# Altium schematic sheet FMC_HPC_UFL_DEBUG_J1_J84.SchDoc: 84 U.FL connectors J1 .. J84 (12 x 7 array)
size A4; Date: 13.12.2024; ApprovedBy: PFH; CompanyName: IAM Electronic GmbH; DrawnBy: PFH; Engineer: PFH; DocumentNumber: 2; Revision: A; SheetNumber: 2; SheetTotal: 9; Projekt: FMC HPC-U.FL Debug Board; Website: www.fmchub.com
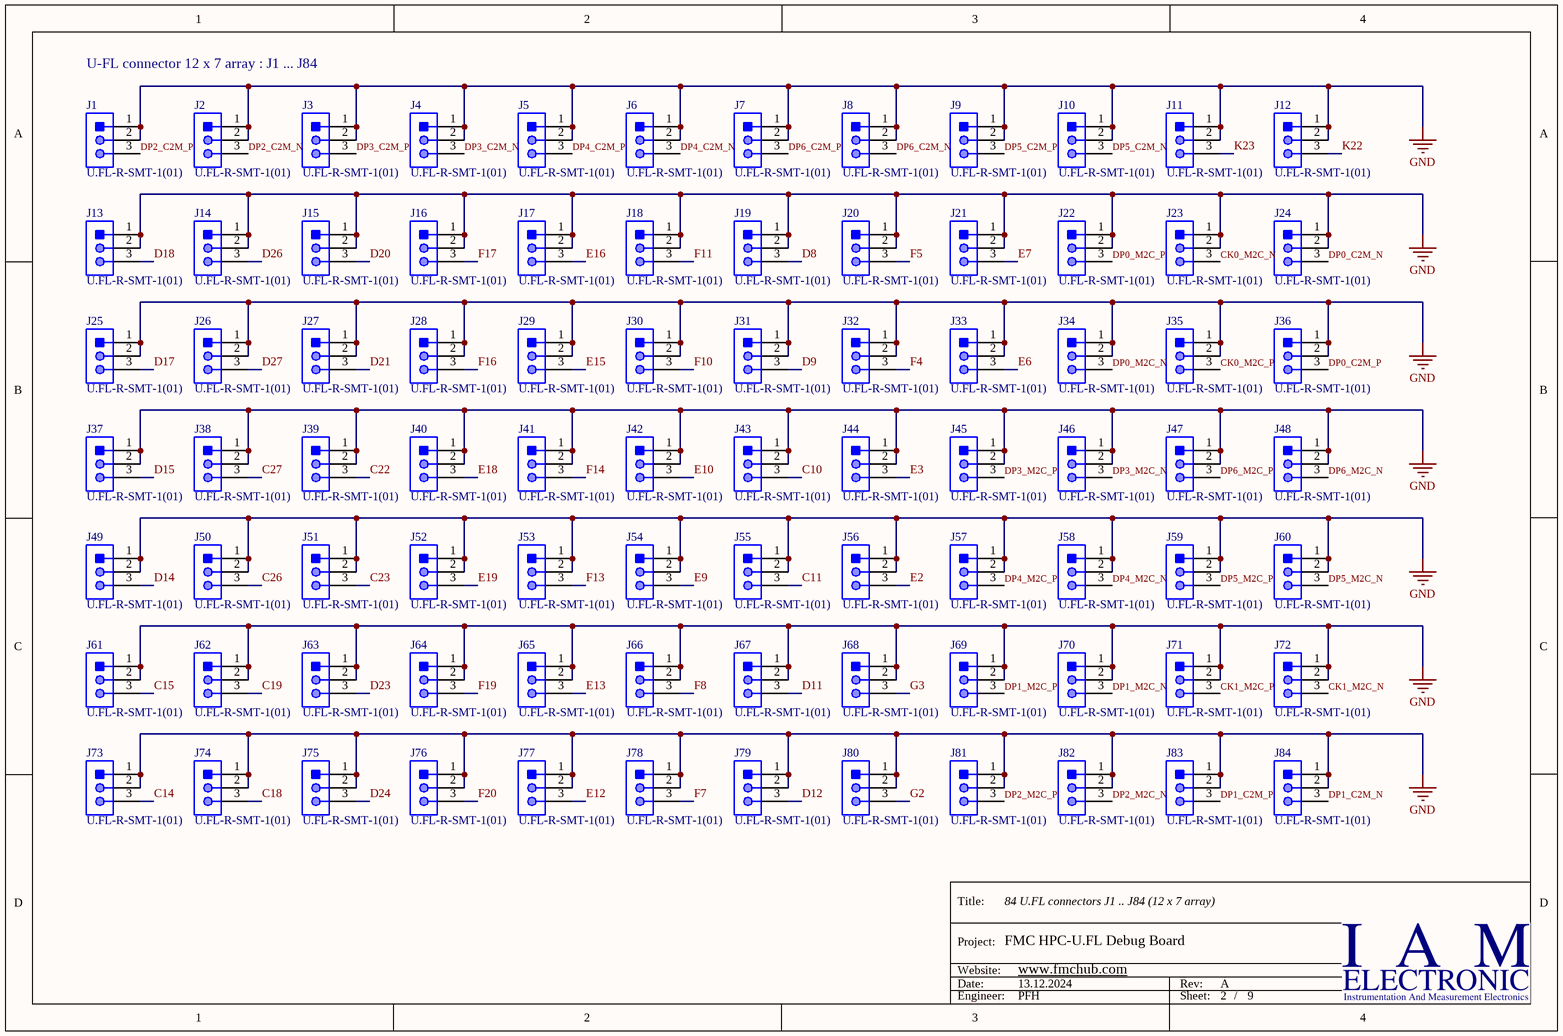
[diagram p0: FMC_HPC_UFL_DEBUG_J1_J84.SchDoc]

## Parts
J1  U.FL-R-SMT-1(01)  [HRS-U.FL-R-SMT-3_V]
J2  U.FL-R-SMT-1(01)  [HRS-U.FL-R-SMT-3_V]
J3  U.FL-R-SMT-1(01)  [HRS-U.FL-R-SMT-3_V]
J4  U.FL-R-SMT-1(01)  [HRS-U.FL-R-SMT-3_V]
J5  U.FL-R-SMT-1(01)  [HRS-U.FL-R-SMT-3_V]
J6  U.FL-R-SMT-1(01)  [HRS-U.FL-R-SMT-3_V]
J7  U.FL-R-SMT-1(01)  [HRS-U.FL-R-SMT-3_V]
J8  U.FL-R-SMT-1(01)  [HRS-U.FL-R-SMT-3_V]
J9  U.FL-R-SMT-1(01)  [HRS-U.FL-R-SMT-3_V]
J10  U.FL-R-SMT-1(01)  [HRS-U.FL-R-SMT-3_V]
J11  U.FL-R-SMT-1(01)  [HRS-U.FL-R-SMT-3_V]
J12  U.FL-R-SMT-1(01)  [HRS-U.FL-R-SMT-3_V]
J13  U.FL-R-SMT-1(01)  [HRS-U.FL-R-SMT-3_V]
J14  U.FL-R-SMT-1(01)  [HRS-U.FL-R-SMT-3_V]
J15  U.FL-R-SMT-1(01)  [HRS-U.FL-R-SMT-3_V]
J16  U.FL-R-SMT-1(01)  [HRS-U.FL-R-SMT-3_V]
J17  U.FL-R-SMT-1(01)  [HRS-U.FL-R-SMT-3_V]
J18  U.FL-R-SMT-1(01)  [HRS-U.FL-R-SMT-3_V]
J19  U.FL-R-SMT-1(01)  [HRS-U.FL-R-SMT-3_V]
J20  U.FL-R-SMT-1(01)  [HRS-U.FL-R-SMT-3_V]
J21  U.FL-R-SMT-1(01)  [HRS-U.FL-R-SMT-3_V]
J22  U.FL-R-SMT-1(01)  [HRS-U.FL-R-SMT-3_V]
J23  U.FL-R-SMT-1(01)  [HRS-U.FL-R-SMT-3_V]
J24  U.FL-R-SMT-1(01)  [HRS-U.FL-R-SMT-3_V]
J25  U.FL-R-SMT-1(01)  [HRS-U.FL-R-SMT-3_V]
J26  U.FL-R-SMT-1(01)  [HRS-U.FL-R-SMT-3_V]
J27  U.FL-R-SMT-1(01)  [HRS-U.FL-R-SMT-3_V]
J28  U.FL-R-SMT-1(01)  [HRS-U.FL-R-SMT-3_V]
J29  U.FL-R-SMT-1(01)  [HRS-U.FL-R-SMT-3_V]
J30  U.FL-R-SMT-1(01)  [HRS-U.FL-R-SMT-3_V]
J31  U.FL-R-SMT-1(01)  [HRS-U.FL-R-SMT-3_V]
J32  U.FL-R-SMT-1(01)  [HRS-U.FL-R-SMT-3_V]
J33  U.FL-R-SMT-1(01)  [HRS-U.FL-R-SMT-3_V]
J34  U.FL-R-SMT-1(01)  [HRS-U.FL-R-SMT-3_V]
J35  U.FL-R-SMT-1(01)  [HRS-U.FL-R-SMT-3_V]
J36  U.FL-R-SMT-1(01)  [HRS-U.FL-R-SMT-3_V]
J37  U.FL-R-SMT-1(01)  [HRS-U.FL-R-SMT-3_V]
J38  U.FL-R-SMT-1(01)  [HRS-U.FL-R-SMT-3_V]
J39  U.FL-R-SMT-1(01)  [HRS-U.FL-R-SMT-3_V]
J40  U.FL-R-SMT-1(01)  [HRS-U.FL-R-SMT-3_V]
J41  U.FL-R-SMT-1(01)  [HRS-U.FL-R-SMT-3_V]
J42  U.FL-R-SMT-1(01)  [HRS-U.FL-R-SMT-3_V]
J43  U.FL-R-SMT-1(01)  [HRS-U.FL-R-SMT-3_V]
J44  U.FL-R-SMT-1(01)  [HRS-U.FL-R-SMT-3_V]
J45  U.FL-R-SMT-1(01)  [HRS-U.FL-R-SMT-3_V]
J46  U.FL-R-SMT-1(01)  [HRS-U.FL-R-SMT-3_V]
J47  U.FL-R-SMT-1(01)  [HRS-U.FL-R-SMT-3_V]
J48  U.FL-R-SMT-1(01)  [HRS-U.FL-R-SMT-3_V]
J49  U.FL-R-SMT-1(01)  [HRS-U.FL-R-SMT-3_V]
J50  U.FL-R-SMT-1(01)  [HRS-U.FL-R-SMT-3_V]
J51  U.FL-R-SMT-1(01)  [HRS-U.FL-R-SMT-3_V]
J52  U.FL-R-SMT-1(01)  [HRS-U.FL-R-SMT-3_V]
J53  U.FL-R-SMT-1(01)  [HRS-U.FL-R-SMT-3_V]
J54  U.FL-R-SMT-1(01)  [HRS-U.FL-R-SMT-3_V]
J55  U.FL-R-SMT-1(01)  [HRS-U.FL-R-SMT-3_V]
J56  U.FL-R-SMT-1(01)  [HRS-U.FL-R-SMT-3_V]
J57  U.FL-R-SMT-1(01)  [HRS-U.FL-R-SMT-3_V]
J58  U.FL-R-SMT-1(01)  [HRS-U.FL-R-SMT-3_V]
J59  U.FL-R-SMT-1(01)  [HRS-U.FL-R-SMT-3_V]
J60  U.FL-R-SMT-1(01)  [HRS-U.FL-R-SMT-3_V]
J61  U.FL-R-SMT-1(01)  [HRS-U.FL-R-SMT-3_V]
J62  U.FL-R-SMT-1(01)  [HRS-U.FL-R-SMT-3_V]
J63  U.FL-R-SMT-1(01)  [HRS-U.FL-R-SMT-3_V]
J64  U.FL-R-SMT-1(01)  [HRS-U.FL-R-SMT-3_V]
J65  U.FL-R-SMT-1(01)  [HRS-U.FL-R-SMT-3_V]
J66  U.FL-R-SMT-1(01)  [HRS-U.FL-R-SMT-3_V]
J67  U.FL-R-SMT-1(01)  [HRS-U.FL-R-SMT-3_V]
J68  U.FL-R-SMT-1(01)  [HRS-U.FL-R-SMT-3_V]
J69  U.FL-R-SMT-1(01)  [HRS-U.FL-R-SMT-3_V]
J70  U.FL-R-SMT-1(01)  [HRS-U.FL-R-SMT-3_V]
J71  U.FL-R-SMT-1(01)  [HRS-U.FL-R-SMT-3_V]
J72  U.FL-R-SMT-1(01)  [HRS-U.FL-R-SMT-3_V]
J73  U.FL-R-SMT-1(01)  [HRS-U.FL-R-SMT-3_V]
J74  U.FL-R-SMT-1(01)  [HRS-U.FL-R-SMT-3_V]
J75  U.FL-R-SMT-1(01)  [HRS-U.FL-R-SMT-3_V]
J76  U.FL-R-SMT-1(01)  [HRS-U.FL-R-SMT-3_V]
J77  U.FL-R-SMT-1(01)  [HRS-U.FL-R-SMT-3_V]
J78  U.FL-R-SMT-1(01)  [HRS-U.FL-R-SMT-3_V]
J79  U.FL-R-SMT-1(01)  [HRS-U.FL-R-SMT-3_V]
J80  U.FL-R-SMT-1(01)  [HRS-U.FL-R-SMT-3_V]
J81  U.FL-R-SMT-1(01)  [HRS-U.FL-R-SMT-3_V]
J82  U.FL-R-SMT-1(01)  [HRS-U.FL-R-SMT-3_V]
J83  U.FL-R-SMT-1(01)  [HRS-U.FL-R-SMT-3_V]
J84  U.FL-R-SMT-1(01)  [HRS-U.FL-R-SMT-3_V]

## Nets
GND: J1.1 J1.2 J2.1 J2.2 J3.1 J3.2 J4.1 J4.2 J5.1 J5.2 J6.1 J6.2 J7.1 J7.2 J8.1 J8.2 J9.1 J9.2 J10.1 J10.2 J11.1 J11.2 J12.1 J12.2 J13.1 J13.2 J14.1 J14.2 J15.1 J15.2 J16.1 J16.2 J17.1 J17.2 J18.1 J18.2 J19.1 J19.2 J20.1 J20.2 J21.1 J21.2 J22.1 J22.2 J23.1 J23.2 J24.1 J24.2 J25.1 J25.2 J26.1 J26.2 J27.1 J27.2 J28.1 J28.2 J29.1 J29.2 J30.1 J30.2 J31.1 J31.2 J32.1 J32.2 J33.1 J33.2 J34.1 J34.2 J35.1 J35.2 J36.1 J36.2 J37.1 J37.2 J38.1 J38.2 J39.1 J39.2 J40.1 J40.2 J41.1 J41.2 J42.1 J42.2 J43.1 J43.2 J44.1 J44.2 J45.1 J45.2 J46.1 J46.2 J47.1 J47.2 J48.1 J48.2 J49.1 J49.2 J50.1 J50.2 J51.1 J51.2 J52.1 J52.2 J53.1 J53.2 J54.1 J54.2 J55.1 J55.2 J56.1 J56.2 J57.1 J57.2 J58.1 J58.2 J59.1 J59.2 J60.1 J60.2 J61.1 J61.2 J62.1 J62.2 J63.1 J63.2 J64.1 J64.2 J65.1 J65.2 J66.1 J66.2 J67.1 J67.2 J68.1 J68.2 J69.1 J69.2 J70.1 J70.2 J71.1 J71.2 J72.1 J72.2 J73.1 J73.2 J74.1 J74.2 J75.1 J75.2 J76.1 J76.2 J77.1 J77.2 J78.1 J78.2 J79.1 J79.2 J80.1 J80.2 J81.1 J81.2 J82.1 J82.2 J83.1 J83.2 J84.1 J84.2
C10: J43.3
C11: J55.3
C14: J73.3
C15: J61.3
C18: J74.3
C19: J62.3
C22: J39.3
C23: J51.3
C26: J50.3
C27: J38.3
CK0_M2C_N: J23.3
CK0_M2C_P: J35.3
CK1_M2C_N: J72.3
CK1_M2C_P: J71.3
D8: J19.3
D9: J31.3
D11: J67.3
D12: J79.3
D14: J49.3
D15: J37.3
D17: J25.3
D18: J13.3
D20: J15.3
D21: J27.3
D23: J63.3
D24: J75.3
D26: J14.3
D27: J26.3
DP0_C2M_N: J24.3
DP0_C2M_P: J36.3
DP0_M2C_N: J34.3
DP0_M2C_P: J22.3
DP1_C2M_N: J84.3
DP1_C2M_P: J83.3
DP1_M2C_N: J70.3
DP1_M2C_P: J69.3
DP2_C2M_N: J2.3
DP2_C2M_P: J1.3
DP2_M2C_N: J82.3
DP2_M2C_P: J81.3
DP3_C2M_N: J4.3
DP3_C2M_P: J3.3
DP3_M2C_N: J46.3
DP3_M2C_P: J45.3
DP4_C2M_N: J6.3
DP4_C2M_P: J5.3
DP4_M2C_N: J58.3
DP4_M2C_P: J57.3
DP5_C2M_N: J10.3
DP5_C2M_P: J9.3
DP5_M2C_N: J60.3
DP5_M2C_P: J59.3
DP6_C2M_N: J8.3
DP6_C2M_P: J7.3
DP6_M2C_N: J48.3
DP6_M2C_P: J47.3
E2: J56.3
E3: J44.3
E6: J33.3
E7: J21.3
E9: J54.3
E10: J42.3
E12: J77.3
E13: J65.3
E15: J29.3
E16: J17.3
E18: J40.3
E19: J52.3
F4: J32.3
F5: J20.3
F7: J78.3
F8: J66.3
F10: J30.3
F11: J18.3
F13: J53.3
F14: J41.3
F16: J28.3
F17: J16.3
F19: J64.3
F20: J76.3
G2: J80.3
G3: J68.3
K22: J12.3
K23: J11.3

## Notes on the sheet
- U-FL connector 12 x 7 array : J1 ... J84
- Title:
- Project:
- Date:
- Website:
- Rev:
- Engineer:
- Sheet:
- /

## Library data of the parts
J1-J84 = CMP-2000-05153-1: Ultra Small Coaxial Connector, 6 GHz, -40 to 90 degC, 3-Pin SMD, RoHS, Bulk; Manufacturer: Hirose Electric; Connector Style: U.FL; Impedance: 50Ohm; Dielectric Material: LiquidCrystalPolymer(LCP); Minimum Quantity: UltraMiniatureCoaxial; Online Catalog: U.FLSeries; Featured Product: HiroseU.FLSeries; Frequency - Max: 6GHz; Other Names: H122041 / U.FL-R-SMT-1(01)-ND; Contact Termination: Solder; Body Material: PhosphorBronze; Connector Type: Jack,MalePin; Body Finish: Silver; Center Contact Plating: Gold; Manufacturer URL: https://www.hirose.com; Family: CoaxialConnectors(RF); Fastening Type: Snap-On; Unit PriceUSD: U.FL; Series: U.FL; Package Reference: U.FL-R-SMT; Packaging: Bulk; Standard Package: 100; Mounting Type: SurfaceMount; Quantity Available: Bulk; Housing Color: Silver; Package Description: 3-Pin Surface Mount Device, Body 2.6 x 2.6 mm; Category: Connectors,Interconnects; Operating Temperature: -40degC~90degC; Center Contact Material: PhosphorBronze; Dynamic Catalog: U.FLSeries; Datasheet URL: https://datasheet.ciiva.com/26945/getdatasheetpartid-475239-26945414.pdf; Datasheet Version: Feb-09; Shield Termination: Solder; Part: U.FL-R-SMT-1(01); Part2: 331-0472-2 01